# Altium project projet_diffo_tcheunang_tayou_pcbb.PrjPcb
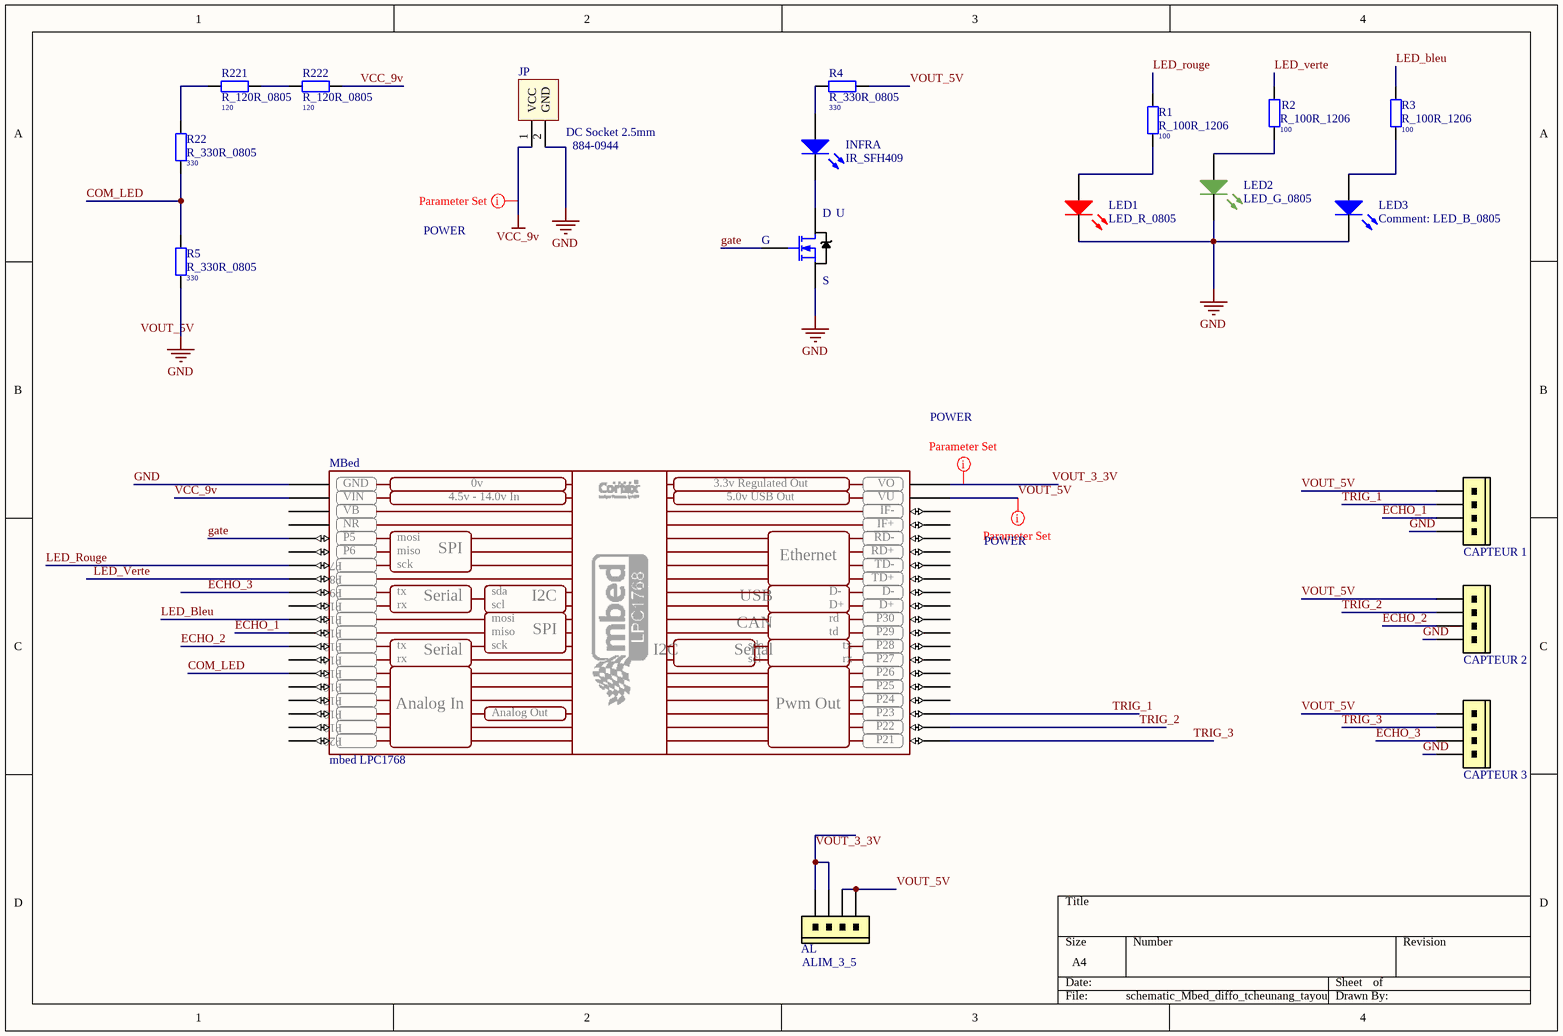
[diagram p0: schematic_Mbed_diffo_tcheunang_tayou.SchDoc]
1 sheet, 19 parts. Net scope: global (net labels, ports and power ports of the same name join across sheets).
Board file: PCB_Mbed_diffo_tcheunang_tayou.PcbDoc

## Sheet schematic_Mbed_diffo_tcheunang_tayou.SchDoc
size A4; SheetNumber: 1; SheetTotal: 1; SPICEModelCacheTDSDONJS: <root> / <DocumentId>TDSDONJS</DocumentId> / <CacheFrame Number="0"> / <Model Name="led1" Kind="MDL"> / <Text>*Typ RED GaAs LED: Vf=1.7V Vr=4V If=40mA trr=3uS / *LED Pinout: 1=A, 2=K / .MODEL LED1 D (IS=93.2P RS=42M N=3.73 BV=4 IBV=10U / + CJO=2.97P VJ=.75 M=.333 TT=4.32U)</Text> / </Model> / </CacheFrame> / </root>

### Parts
(Parts that share a designator on the sheet are numbered #1, #2 ... from top to bottom, then left to right.)
#1  CAPTEUR 1  [MOLEX-KK-22-27-2041]
#2  CAPTEUR 2  [MOLEX-KK-22-27-2041]
#3  CAPTEUR 3  [MOLEX-KK-22-27-2041]
AL  ALIM_3_5  [MOLEX-KK-22-27-2041]
INFRA  IR_SFH409  [LED-1]
JP  DC Socket 2.5mm  Supplier Part Number 1: 884-0944  [DC 2.5mm]
LED1  LED_R_0805  [Led - 0805]
LED2  LED_G_0805  [Led - 0805]
LED3  LED_B_0805  [Led - 0805]
MBed  mbed LPC1768  [DIP40-LARGE]
R1  R_100R_1206  value 100  [RESC3116X06N]
R2  R_100R_1206  value 100  [RESC3116X06N]
R3  R_100R_1206  value 100  [RESC3116X06N]
R4  R_330R_0805  value 330  [RESC2012X05N]
R5  R_330R_0805  value 330  [RESC2012X05N]
R22  R_330R_0805  value 330  [RESC2012X05N]
R221  R_120R_0805  value 120  [RESC2012X05N]
R222  R_120R_0805  value 120  [RESC2012X05N]
U  T_NMOS_100V_10A_DPAK  [DPAK228P990X238-3N]  (value not drawn)

### Nets
GND: #1.4 #2.4 #3.4 JP.2(GND) LED1.2(K) LED2.2(K) LED3.2(K) MBed.1(GND) R5.1 U.2(S)
VCC_9v: JP.1(VCC) MBed.2(VIN) R222.2
COM_LED: MBed.15(P15) R5.2 R22.1
ECHO_1: #1.3 MBed.12(P12)
ECHO_2: #2.3 MBed.13(P13)
ECHO_3: #3.3 MBed.9(P9)
gate: MBed.5(P5) U.1(G)
LED_bleu: MBed.11(P11) R3.2
LED_rouge: MBed.7(P7) R1.2
LED_verte: MBed.8(P8) R2.2
TRIG_1: #1.2 MBed.23(P23)
TRIG_2: #2.2 MBed.22(P22)
TRIG_3: #3.2 MBed.21(P21)
VOUT_3_3V: AL.3 AL.4 MBed.40(VO)
VOUT_5V: #1.1 #2.1 #3.1 AL.1 AL.2 MBed.39(VU) R4.1
NetINFRA_1: INFRA.1(A) R4.2
NetINFRA_2: INFRA.2(K) U.3(D)
NetLED1_1: LED1.1(A) R1.1
NetLED2_1: LED2.1(A) R2.1
NetLED3_1: LED3.1(A) R3.1
NetR22_2: R22.2 R221.1
NetR221_2: R221.2 R222.1

Not connected (* = marked no-connect by the designer): MBed 3(VB) 4(NR) 6(P6) 10(P10) 14(P14) 16(P16) 17(P17) 18(P18) 19(P19) 20(P20) 24(P24) 25(P25) 26(P26) 27(P27) 28(P28) 29(P29) 30(P30) 31(D+) 32(D-) 33(TD+) 34(TD-) 35(RD+) 36(RD-) 37(IF+) 38(IF-)

### Layout directives
net class POWER: VCC_9v, VOUT_3_3V, VOUT_5V

### Notes on the sheet
- Labels drawn without touching a wire or pin: VOUT_5V
- (in symbol mbed LPC1768) 0v; 3.3v Regulated Out; 4.5v - 14.0v In; 5.0v USB Out; mosi; miso; SPI; Ethernet; sck; tx; sda; Serial; I2C; USB; rx; scl; rd; CAN; td; Analog In; Pwm Out; Analog Out

### Library data of the parts
#1-#3 AL = MOLEX_KK_4CTS_VERTICAL: 2.54mm (.100") Pitch KK® Wire-to-Board Header, Vertical, with Friction Lock, 4 Circuits
INFRA = LED1: Typical RED GaAs LED; Published: 8-Jun-2000; LatestRevisionDate: 08-Jul-2005; LatestRevisionNote: Mech Layer 1 removed.; PackageReference: LED-1; Publisher: Altium Limited; PackageDescription: LED; 2 Leads
JP = DC Socket 2.5mm: DC Socket 2.5mm 16V 2A; Supplier 1: RS-Components
LED1 = LED_R_0805: Red GaAlAs LED 0805 41mcd 160°; Supplier 1: RSComponents; Supplier Part Number 1: 1217787; Mounting: YES
LED2 = LED_G_0805: Green GaAs LED 0805 6mcd 130°; Published: 8-Jun-2000; LatestRevisionDate: 17-Jul-2002; LatestRevisionNote: Re-released for DXP Platform.; PackageVersion: Feb-2002; PackageReference: 3.2X1.6X1.1; Publisher: Altium Limited; PackageDescription: SM LED; 2 Flat Leads; Supplier 1: RSComponents; Supplier Part Number 1: 1689723; Mounting: YES
LED3 = LED_B_0805: Blue InGaN LED 0805 180mcd 130°; Supplier 1: RSComponents; Supplier Part Number 1: 1689728; Mounting: YES
MBed = mbed LPC1768: Prototyping Board; Supplier 1: Farnell; Supplier 2: RS-Components; Supplier Part Number 1: 1761179; Supplier Part Number 2: 769-4182
R1-R3 = R_100R_1206: Resistor 100 Ohms 1/3W 1206 1%; Supplier 1: Farnell; Supplier Part Number 1: 2689160; Mounting: YES
R4 R5 R22 = R_330R_0805: Resistor 330 Ohms 0.5W 0805 1%; Mounting: YES; Supplier 1: RSComponents
R221 R222 = R_120R_0805: Resistor 120 Ohms 0.5W 0805 5%; Supplier 1: RSComponents; Supplier Part Number 1: 1621662; Mounting: YES
U = T_NMOS_100V_10A_DPAK: IRLR120 MOSFET N-CH 100V 10A DPAK; Supplier 1: Farnell; Supplier Part Number 1: 2781153; Mounting: YES